# Altium schematic sheet CAN_Interface.SchDoc
size A
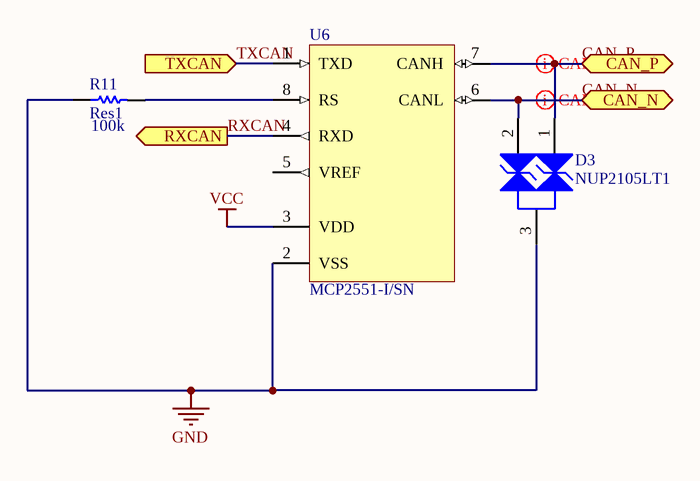
[diagram p0: CAN_Interface.SchDoc]

## Parts
D3  NUP2105LT1  [ONSC-SOT-23-3-318-08_V]
R11  Res1  value 100k  [6-0805_L]
U6  MCP2551-I/SN  [SOIC-SN8_N]

## Ports
CAN_N (bidir), CAN_P (bidir), RXCAN (out), TXCAN (in)

## Nets
GND: D3.3(K) R11.1 U6.2(VSS)
VCC: U6.3(VDD)
CAN_N: D3.2(K) U6.6(CANL) ; port CAN_N
CAN_P: D3.1(K) U6.7(CANH) ; port CAN_P
RXCAN: U6.4(RXD) ; port RXCAN
TXCAN: U6.1(TXD) ; port TXCAN
NetR11_2: R11.2 U6.8(RS)

Not connected (* = marked no-connect by the designer): U6 5(VREF)

## Layout directives
differential pair; rule Matched Net Lengths [Tolerance = 1000mil]: CAN_P
differential pair: CAN_N

## Library data of the parts
D3 = CMP-1063-00165-1: Dual Line CAN Bus Protector, 3-Pin SOT-23, Tape and Reel; Manufacturer: On Semiconductor; PPK Max (W): 350; IR Max (uA): 0.1; Number of Lines: 2; V(BR) Min (V): 26.2; Direction: Bidirectional; C Max (pF): 30; PackageDescription: 3-Pin Small Outline Transistor, Body 2.92 x 1.3 mm, Pitch 0.95 mm; ComponentLink2URL: http://www.onsemi.cn/pub_link/Collateral/NUP2105L-D.PDF; ComponentLink3Description: Package Specification; ComponentLink2Description: Datasheet; ComponentLink1URL: http://www.onsemi.com/; Mounting Technology: Surface Mount; ComponentLink1Description: Manufacturer URL; Packing: Tape and Reel; PackageVersion: Rev. AP, 11/2009; PartNumber: NUP2105LT1; DatasheetVersion: Rev. 5; ComponentLink3URL: http://www.onsemi.cn/pub_link/Collateral/318-08.PDF; PackageReference: SOT-23-3-318-08
R11 = Res1: Resistor; Published: 8-Jun-2000; LatestRevisionDate: 17-Jul-2002; LatestRevisionNote: Re-released for DXP Platform.; PackageReference: AXIAL-0.3; Publisher: Altium Limited; PackageDescription: Axial Device, Thru-Hole; 2 Leads; 0.3 in Pin Spacing
U6 = CMP-0186-00138-2: High-Speed CAN Transceiver, 8-Pin SOIC, Industrial Temperature; Code_JEDEC: MS-012; ComponentLink3URL: http://www.microchip.com/stellent/groups/techpub_sg/documents/packagingspec/en012702.pdf; DatasheetVersion: revF, Jul-2010; PackageVersion: revBB, Aug-2009; PackageDescription: 8-Lead Plastic Small Outline (SN) - Narrow, 3.90mm Body [SOIC]; ComponentLink1URL: http://www.microchip.com/; ComponentLink3Description: Package Specification; ComponentLink2Description: Datasheet; Code_IPC: SOIC127P600-8; ComponentLink1Description: Manufacturer URL; PackageReference: SOIC-SN8; ComponentLink2URL: http://ww1.microchip.com/downloads/en/DeviceDoc/21667F.pdf; RevisionNote: URLs added. DatasheetVersion updated.